# EAGLE schematic Grid (EAGLE 6.6.0)
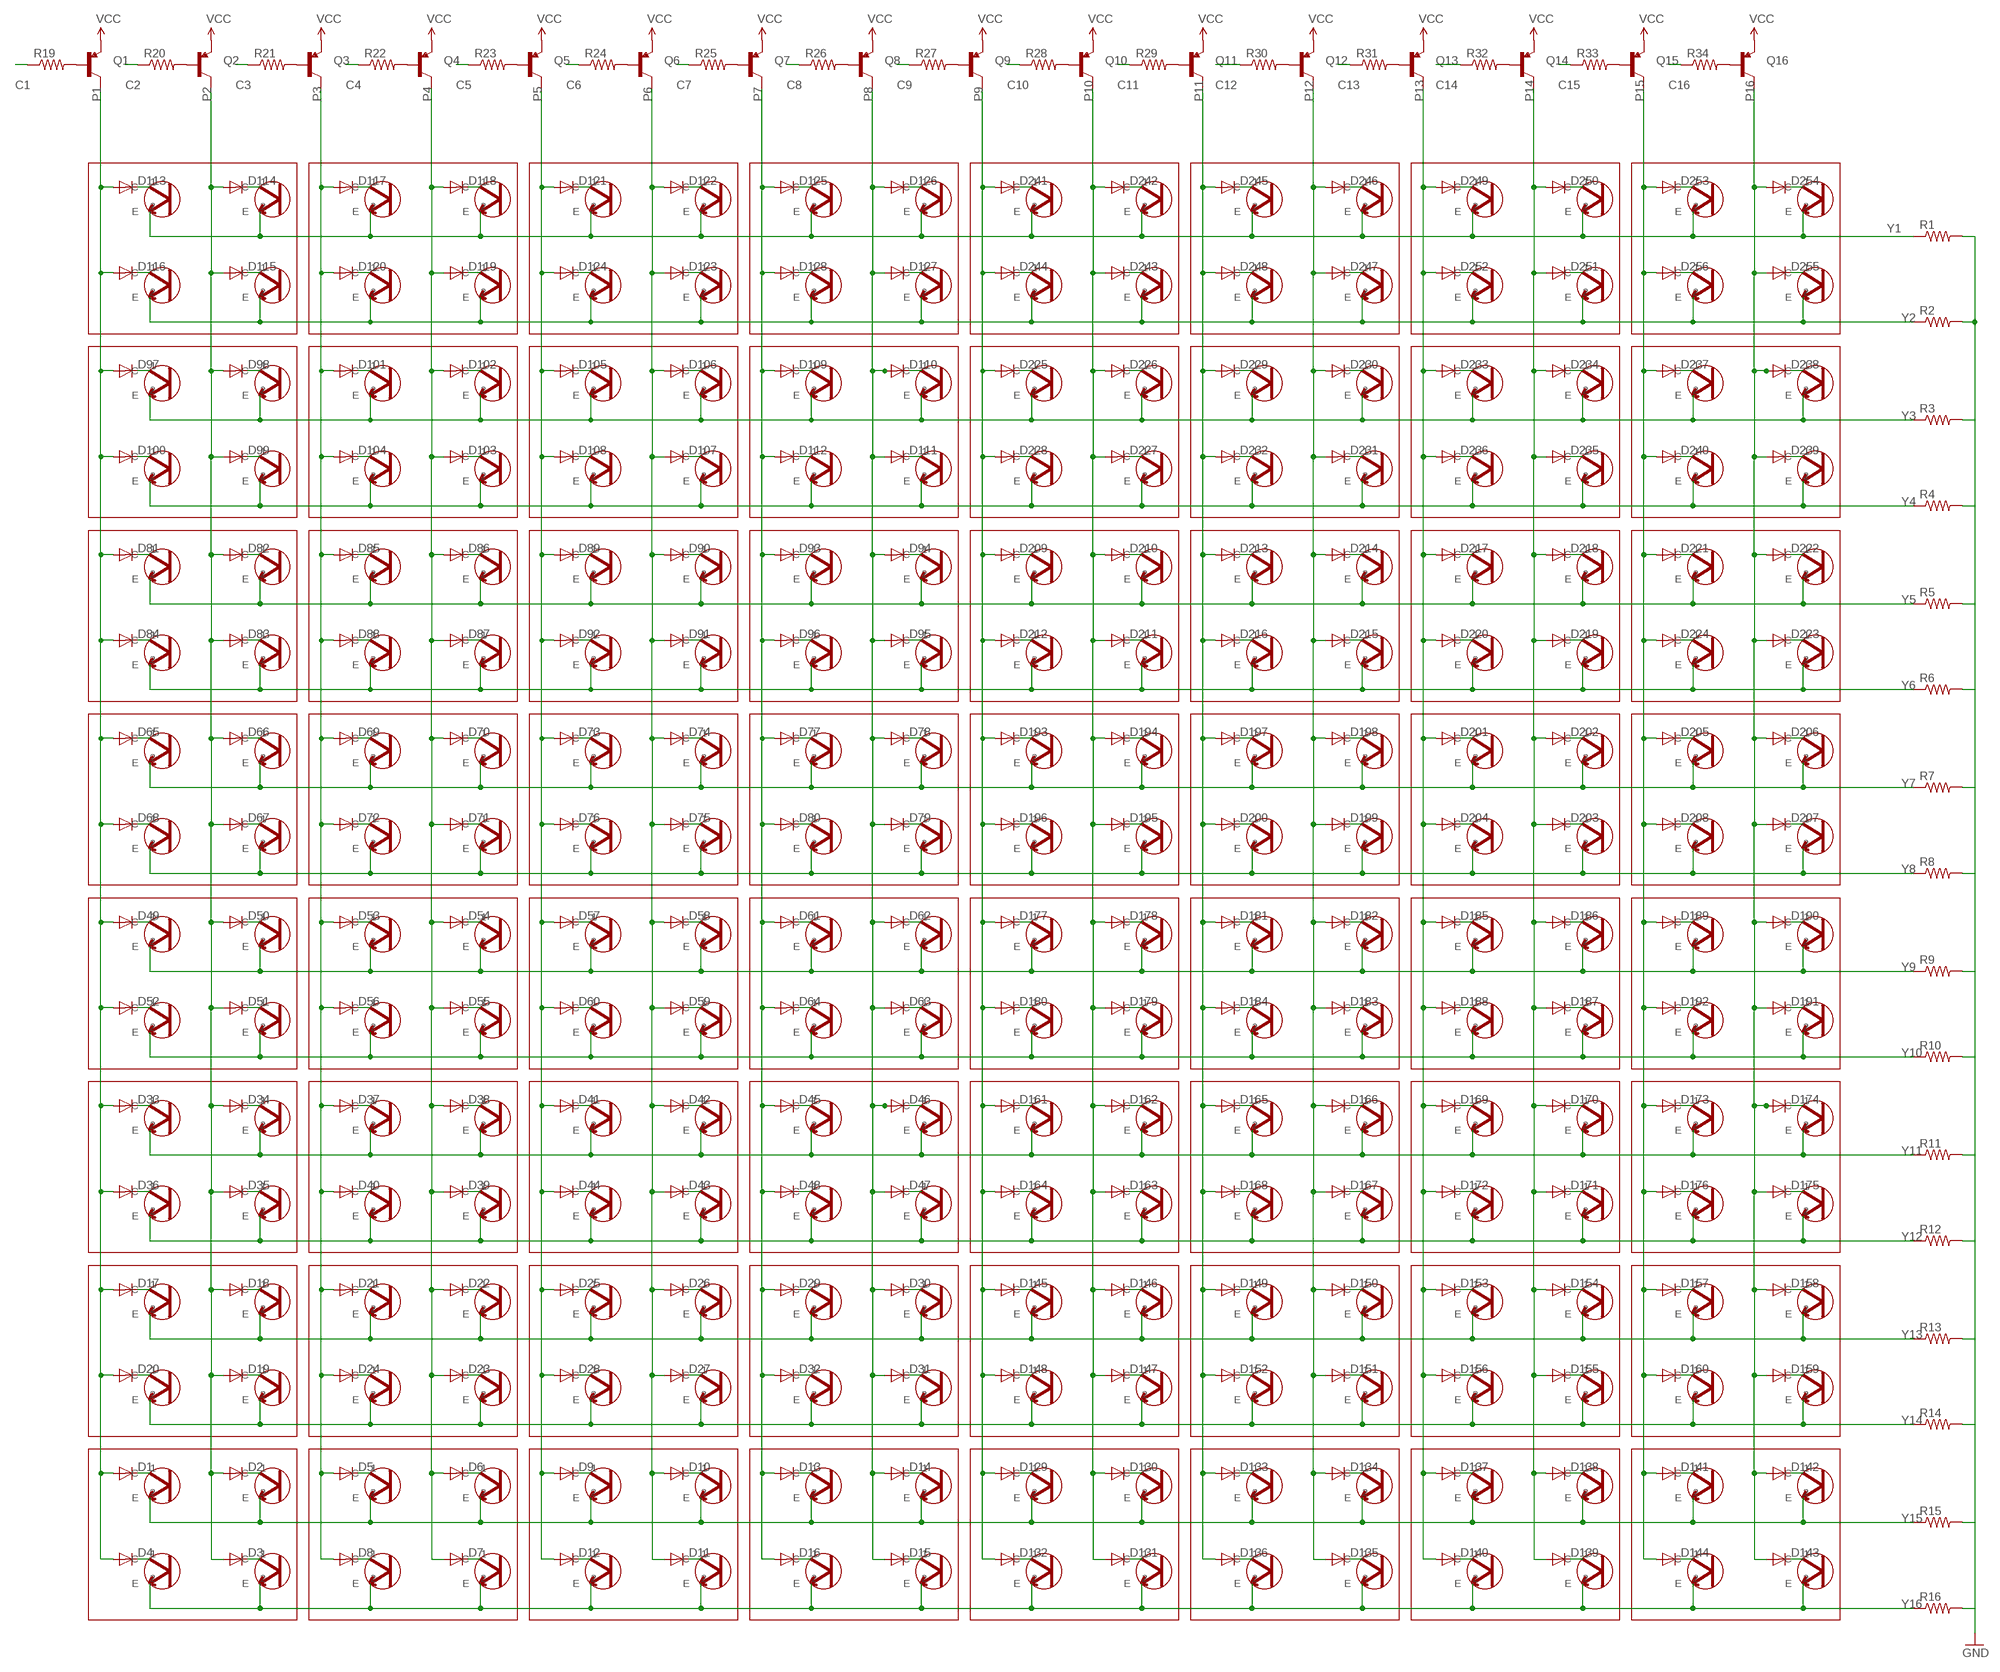
[diagram p0: schematic, sheet 1, part 1 of 2]
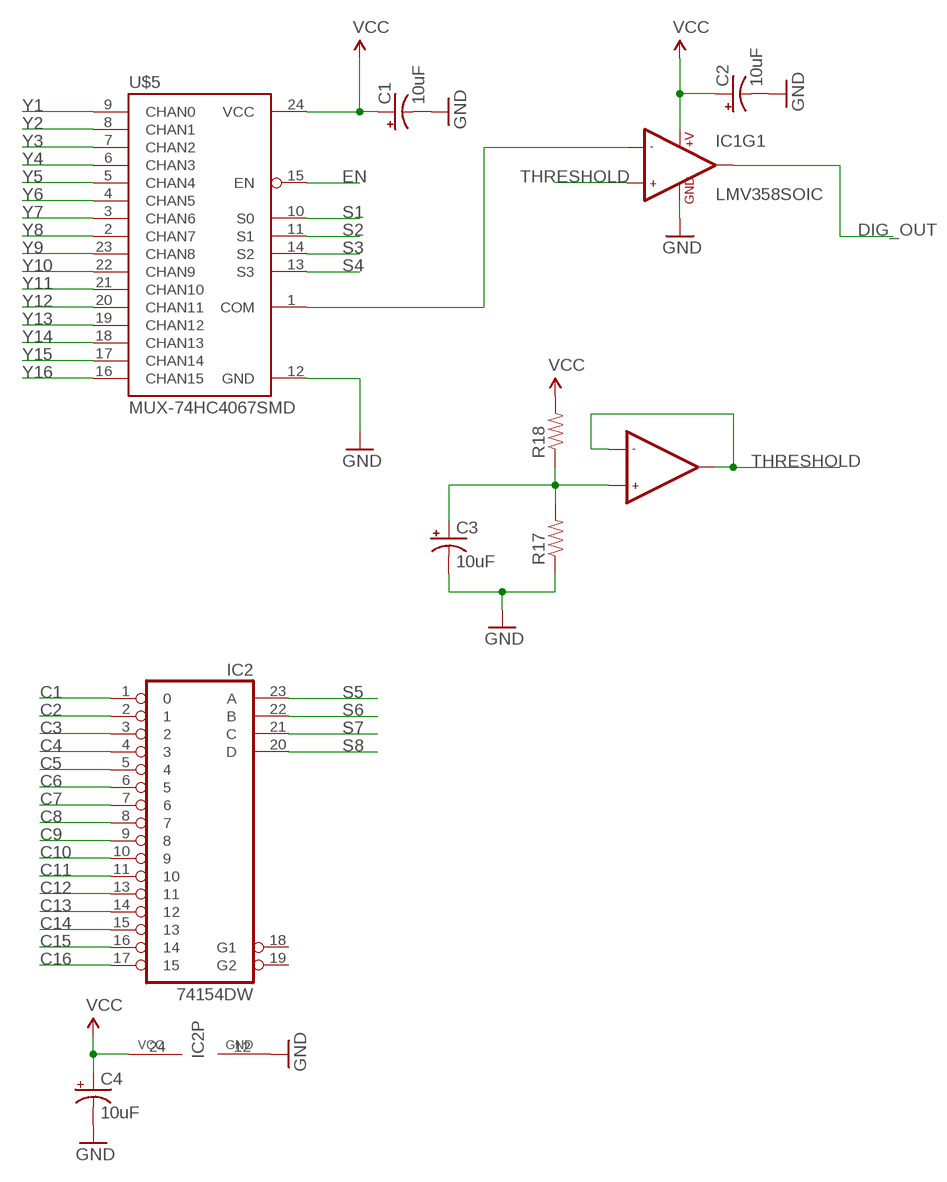
[diagram p1: schematic, sheet 1, part 2 of 2]

## Parts
C1  10uF  CAP_POL1206  [EIA3216]
C2  10uF  CAP_POL1206  [EIA3216]
C3  10uF  CAP_POL1206  [EIA3216]
C4  10uF  CAP_POL1206  [EIA3216]
D1  DIODESOD  [SOD-323]
D2  DIODESOD  [SOD-323]
D3  DIODESOD  [SOD-323]
D4  DIODESOD  [SOD-323]
D5  DIODESOD  [SOD-323]
D6  DIODESOD  [SOD-323]
D7  DIODESOD  [SOD-323]
D8  DIODESOD  [SOD-323]
D9  DIODESOD  [SOD-323]
D10  DIODESOD  [SOD-323]
D11  DIODESOD  [SOD-323]
D12  DIODESOD  [SOD-323]
D13  DIODESOD  [SOD-323]
D14  DIODESOD  [SOD-323]
D15  DIODESOD  [SOD-323]
D16  DIODESOD  [SOD-323]
D17  DIODESOD  [SOD-323]
D18  DIODESOD  [SOD-323]
D19  DIODESOD  [SOD-323]
D20  DIODESOD  [SOD-323]
D21  DIODESOD  [SOD-323]
D22  DIODESOD  [SOD-323]
D23  DIODESOD  [SOD-323]
D24  DIODESOD  [SOD-323]
D25  DIODESOD  [SOD-323]
D26  DIODESOD  [SOD-323]
D27  DIODESOD  [SOD-323]
D28  DIODESOD  [SOD-323]
D29  DIODESOD  [SOD-323]
D30  DIODESOD  [SOD-323]
D31  DIODESOD  [SOD-323]
D32  DIODESOD  [SOD-323]
D33  DIODESOD  [SOD-323]
D34  DIODESOD  [SOD-323]
D35  DIODESOD  [SOD-323]
D36  DIODESOD  [SOD-323]
D37  DIODESOD  [SOD-323]
D38  DIODESOD  [SOD-323]
D39  DIODESOD  [SOD-323]
D40  DIODESOD  [SOD-323]
D41  DIODESOD  [SOD-323]
D42  DIODESOD  [SOD-323]
D43  DIODESOD  [SOD-323]
D44  DIODESOD  [SOD-323]
D45  DIODESOD  [SOD-323]
D46  DIODESOD  [SOD-323]
D47  DIODESOD  [SOD-323]
D48  DIODESOD  [SOD-323]
D49  DIODESOD  [SOD-323]
D50  DIODESOD  [SOD-323]
D51  DIODESOD  [SOD-323]
D52  DIODESOD  [SOD-323]
D53  DIODESOD  [SOD-323]
D54  DIODESOD  [SOD-323]
D55  DIODESOD  [SOD-323]
D56  DIODESOD  [SOD-323]
D57  DIODESOD  [SOD-323]
D58  DIODESOD  [SOD-323]
D59  DIODESOD  [SOD-323]
D60  DIODESOD  [SOD-323]
D61  DIODESOD  [SOD-323]
D62  DIODESOD  [SOD-323]
D63  DIODESOD  [SOD-323]
D64  DIODESOD  [SOD-323]
D65  DIODESOD  [SOD-323]
D66  DIODESOD  [SOD-323]
D67  DIODESOD  [SOD-323]
D68  DIODESOD  [SOD-323]
D69  DIODESOD  [SOD-323]
D70  DIODESOD  [SOD-323]
D71  DIODESOD  [SOD-323]
D72  DIODESOD  [SOD-323]
D73  DIODESOD  [SOD-323]
D74  DIODESOD  [SOD-323]
D75  DIODESOD  [SOD-323]
D76  DIODESOD  [SOD-323]
D77  DIODESOD  [SOD-323]
D78  DIODESOD  [SOD-323]
D79  DIODESOD  [SOD-323]
D80  DIODESOD  [SOD-323]
D81  DIODESOD  [SOD-323]
D82  DIODESOD  [SOD-323]
D83  DIODESOD  [SOD-323]
D84  DIODESOD  [SOD-323]
D85  DIODESOD  [SOD-323]
D86  DIODESOD  [SOD-323]
D87  DIODESOD  [SOD-323]
D88  DIODESOD  [SOD-323]
D89  DIODESOD  [SOD-323]
D90  DIODESOD  [SOD-323]
D91  DIODESOD  [SOD-323]
D92  DIODESOD  [SOD-323]
D93  DIODESOD  [SOD-323]
D94  DIODESOD  [SOD-323]
D95  DIODESOD  [SOD-323]
D96  DIODESOD  [SOD-323]
D97  DIODESOD  [SOD-323]
D98  DIODESOD  [SOD-323]
D99  DIODESOD  [SOD-323]
D100  DIODESOD  [SOD-323]
D101  DIODESOD  [SOD-323]
D102  DIODESOD  [SOD-323]
D103  DIODESOD  [SOD-323]
D104  DIODESOD  [SOD-323]
D105  DIODESOD  [SOD-323]
D106  DIODESOD  [SOD-323]
D107  DIODESOD  [SOD-323]
D108  DIODESOD  [SOD-323]
D109  DIODESOD  [SOD-323]
D110  DIODESOD  [SOD-323]
D111  DIODESOD  [SOD-323]
D112  DIODESOD  [SOD-323]
D113  DIODESOD  [SOD-323]
D114  DIODESOD  [SOD-323]
D115  DIODESOD  [SOD-323]
D116  DIODESOD  [SOD-323]
D117  DIODESOD  [SOD-323]
D118  DIODESOD  [SOD-323]
D119  DIODESOD  [SOD-323]
D120  DIODESOD  [SOD-323]
D121  DIODESOD  [SOD-323]
D122  DIODESOD  [SOD-323]
D123  DIODESOD  [SOD-323]
D124  DIODESOD  [SOD-323]
D125  DIODESOD  [SOD-323]
D126  DIODESOD  [SOD-323]
D127  DIODESOD  [SOD-323]
D128  DIODESOD  [SOD-323]
D129  DIODESOD  [SOD-323]
D130  DIODESOD  [SOD-323]
D131  DIODESOD  [SOD-323]
D132  DIODESOD  [SOD-323]
D133  DIODESOD  [SOD-323]
D134  DIODESOD  [SOD-323]
D135  DIODESOD  [SOD-323]
D136  DIODESOD  [SOD-323]
D137  DIODESOD  [SOD-323]
D138  DIODESOD  [SOD-323]
D139  DIODESOD  [SOD-323]
D140  DIODESOD  [SOD-323]
D141  DIODESOD  [SOD-323]
D142  DIODESOD  [SOD-323]
D143  DIODESOD  [SOD-323]
D144  DIODESOD  [SOD-323]
D145  DIODESOD  [SOD-323]
D146  DIODESOD  [SOD-323]
D147  DIODESOD  [SOD-323]
D148  DIODESOD  [SOD-323]
D149  DIODESOD  [SOD-323]
D150  DIODESOD  [SOD-323]
D151  DIODESOD  [SOD-323]
D152  DIODESOD  [SOD-323]
D153  DIODESOD  [SOD-323]
D154  DIODESOD  [SOD-323]
D155  DIODESOD  [SOD-323]
D156  DIODESOD  [SOD-323]
D157  DIODESOD  [SOD-323]
D158  DIODESOD  [SOD-323]
D159  DIODESOD  [SOD-323]
D160  DIODESOD  [SOD-323]
D161  DIODESOD  [SOD-323]
D162  DIODESOD  [SOD-323]
D163  DIODESOD  [SOD-323]
D164  DIODESOD  [SOD-323]
D165  DIODESOD  [SOD-323]
D166  DIODESOD  [SOD-323]
D167  DIODESOD  [SOD-323]
D168  DIODESOD  [SOD-323]
D169  DIODESOD  [SOD-323]
D170  DIODESOD  [SOD-323]
D171  DIODESOD  [SOD-323]
D172  DIODESOD  [SOD-323]
D173  DIODESOD  [SOD-323]
D174  DIODESOD  [SOD-323]
D175  DIODESOD  [SOD-323]
D176  DIODESOD  [SOD-323]
D177  DIODESOD  [SOD-323]
D178  DIODESOD  [SOD-323]
D179  DIODESOD  [SOD-323]
D180  DIODESOD  [SOD-323]
D181  DIODESOD  [SOD-323]
D182  DIODESOD  [SOD-323]
D183  DIODESOD  [SOD-323]
D184  DIODESOD  [SOD-323]
D185  DIODESOD  [SOD-323]
D186  DIODESOD  [SOD-323]
D187  DIODESOD  [SOD-323]
D188  DIODESOD  [SOD-323]
D189  DIODESOD  [SOD-323]
D190  DIODESOD  [SOD-323]
D191  DIODESOD  [SOD-323]
D192  DIODESOD  [SOD-323]
D193  DIODESOD  [SOD-323]
D194  DIODESOD  [SOD-323]
D195  DIODESOD  [SOD-323]
D196  DIODESOD  [SOD-323]
D197  DIODESOD  [SOD-323]
D198  DIODESOD  [SOD-323]
D199  DIODESOD  [SOD-323]
D200  DIODESOD  [SOD-323]
D201  DIODESOD  [SOD-323]
D202  DIODESOD  [SOD-323]
D203  DIODESOD  [SOD-323]
D204  DIODESOD  [SOD-323]
D205  DIODESOD  [SOD-323]
D206  DIODESOD  [SOD-323]
D207  DIODESOD  [SOD-323]
D208  DIODESOD  [SOD-323]
D209  DIODESOD  [SOD-323]
D210  DIODESOD  [SOD-323]
D211  DIODESOD  [SOD-323]
D212  DIODESOD  [SOD-323]
D213  DIODESOD  [SOD-323]
D214  DIODESOD  [SOD-323]
D215  DIODESOD  [SOD-323]
D216  DIODESOD  [SOD-323]
D217  DIODESOD  [SOD-323]
D218  DIODESOD  [SOD-323]
D219  DIODESOD  [SOD-323]
D220  DIODESOD  [SOD-323]
D221  DIODESOD  [SOD-323]
D222  DIODESOD  [SOD-323]
D223  DIODESOD  [SOD-323]
D224  DIODESOD  [SOD-323]
D225  DIODESOD  [SOD-323]
D226  DIODESOD  [SOD-323]
D227  DIODESOD  [SOD-323]
D228  DIODESOD  [SOD-323]
D229  DIODESOD  [SOD-323]
D230  DIODESOD  [SOD-323]
D231  DIODESOD  [SOD-323]
D232  DIODESOD  [SOD-323]
D233  DIODESOD  [SOD-323]
D234  DIODESOD  [SOD-323]
D235  DIODESOD  [SOD-323]
D236  DIODESOD  [SOD-323]
D237  DIODESOD  [SOD-323]
D238  DIODESOD  [SOD-323]
D239  DIODESOD  [SOD-323]
D240  DIODESOD  [SOD-323]
D241  DIODESOD  [SOD-323]
D242  DIODESOD  [SOD-323]
D243  DIODESOD  [SOD-323]
D244  DIODESOD  [SOD-323]
D245  DIODESOD  [SOD-323]
D246  DIODESOD  [SOD-323]
D247  DIODESOD  [SOD-323]
D248  DIODESOD  [SOD-323]
D249  DIODESOD  [SOD-323]
D250  DIODESOD  [SOD-323]
D251  DIODESOD  [SOD-323]
D252  DIODESOD  [SOD-323]
D253  DIODESOD  [SOD-323]
D254  DIODESOD  [SOD-323]
D255  DIODESOD  [SOD-323]
D256  DIODESOD  [SOD-323]
IC1  LMV358SOIC  [SO08]
IC2  74154DW  [SO24W]
Q1  TRANSISTOR_PNPSMD  [SOT23-3]
Q2  TRANSISTOR_PNPSMD  [SOT23-3]
Q3  TRANSISTOR_PNPSMD  [SOT23-3]
Q4  TRANSISTOR_PNPSMD  [SOT23-3]
Q5  TRANSISTOR_PNPSMD  [SOT23-3]
Q6  TRANSISTOR_PNPSMD  [SOT23-3]
Q7  TRANSISTOR_PNPSMD  [SOT23-3]
Q8  TRANSISTOR_PNPSMD  [SOT23-3]
Q9  TRANSISTOR_PNPSMD  [SOT23-3]
Q10  TRANSISTOR_PNPSMD  [SOT23-3]
Q11  TRANSISTOR_PNPSMD  [SOT23-3]
Q12  TRANSISTOR_PNPSMD  [SOT23-3]
Q13  TRANSISTOR_PNPSMD  [SOT23-3]
Q14  TRANSISTOR_PNPSMD  [SOT23-3]
Q15  TRANSISTOR_PNPSMD  [SOT23-3]
Q16  TRANSISTOR_PNPSMD  [SOT23-3]
R1  RESISTOR0603  [0603-RES]
R2  RESISTOR0603  [0603-RES]
R3  RESISTOR0603  [0603-RES]
R4  RESISTOR0603  [0603-RES]
R5  RESISTOR0603  [0603-RES]
R6  RESISTOR0603  [0603-RES]
R7  RESISTOR0603  [0603-RES]
R8  RESISTOR0603  [0603-RES]
R9  RESISTOR0603  [0603-RES]
R10  RESISTOR0603  [0603-RES]
R11  RESISTOR0603  [0603-RES]
R12  RESISTOR0603  [0603-RES]
R13  RESISTOR0603  [0603-RES]
R14  RESISTOR0603  [0603-RES]
R15  RESISTOR0603  [0603-RES]
R16  RESISTOR0603  [0603-RES]
R17  RESISTOR0603  [0603-RES]
R18  RESISTOR0603  [0603-RES]
R19  RESISTOR0603  [0603-RES]
R20  RESISTOR0603  [0603-RES]
R21  RESISTOR0603  [0603-RES]
R22  RESISTOR0603  [0603-RES]
R23  RESISTOR0603  [0603-RES]
R24  RESISTOR0603  [0603-RES]
R25  RESISTOR0603  [0603-RES]
R26  RESISTOR0603  [0603-RES]
R27  RESISTOR0603  [0603-RES]
R28  RESISTOR0603  [0603-RES]
R29  RESISTOR0603  [0603-RES]
R30  RESISTOR0603  [0603-RES]
R31  RESISTOR0603  [0603-RES]
R32  RESISTOR0603  [0603-RES]
R33  RESISTOR0603  [0603-RES]
R34  RESISTOR0603  [0603-RES]
U$1  PT15-21B  [1206]
U$2  PT15-21B  [1206]
U$3  PT15-21B  [1206]
U$4  PT15-21B  [1206]
U$5  MUX-74HC4067SMD  [SSOP24]
U$6  PT15-21B  [1206]
U$7  PT15-21B  [1206]
U$8  PT15-21B  [1206]
U$9  PT15-21B  [1206]
U$10  PT15-21B  [1206]
U$11  PT15-21B  [1206]
U$12  PT15-21B  [1206]
U$13  PT15-21B  [1206]
U$14  PT15-21B  [1206]
U$15  PT15-21B  [1206]
U$16  PT15-21B  [1206]
U$17  PT15-21B  [1206]
U$18  PT15-21B  [1206]
U$19  PT15-21B  [1206]
U$20  PT15-21B  [1206]
U$21  PT15-21B  [1206]
U$22  PT15-21B  [1206]
U$23  PT15-21B  [1206]
U$24  PT15-21B  [1206]
U$25  PT15-21B  [1206]
U$26  PT15-21B  [1206]
U$27  PT15-21B  [1206]
U$28  PT15-21B  [1206]
U$29  PT15-21B  [1206]
U$30  PT15-21B  [1206]
U$31  PT15-21B  [1206]
U$32  PT15-21B  [1206]
U$33  PT15-21B  [1206]
U$34  PT15-21B  [1206]
U$35  PT15-21B  [1206]
U$36  PT15-21B  [1206]
U$37  PT15-21B  [1206]
U$38  PT15-21B  [1206]
U$39  PT15-21B  [1206]
U$40  PT15-21B  [1206]
U$41  PT15-21B  [1206]
U$42  PT15-21B  [1206]
U$43  PT15-21B  [1206]
U$44  PT15-21B  [1206]
U$45  PT15-21B  [1206]
U$46  PT15-21B  [1206]
U$47  PT15-21B  [1206]
U$48  PT15-21B  [1206]
U$49  PT15-21B  [1206]
U$50  PT15-21B  [1206]
U$51  PT15-21B  [1206]
U$52  PT15-21B  [1206]
U$53  PT15-21B  [1206]
U$54  PT15-21B  [1206]
U$55  PT15-21B  [1206]
U$56  PT15-21B  [1206]
U$57  PT15-21B  [1206]
U$58  PT15-21B  [1206]
U$59  PT15-21B  [1206]
U$60  PT15-21B  [1206]
U$61  PT15-21B  [1206]
U$62  PT15-21B  [1206]
U$63  PT15-21B  [1206]
U$64  PT15-21B  [1206]
U$65  PT15-21B  [1206]
U$66  PT15-21B  [1206]
U$67  PT15-21B  [1206]
U$68  PT15-21B  [1206]
U$69  PT15-21B  [1206]
U$70  PT15-21B  [1206]
U$71  PT15-21B  [1206]
U$72  PT15-21B  [1206]
U$73  PT15-21B  [1206]
U$74  PT15-21B  [1206]
U$75  PT15-21B  [1206]
U$76  PT15-21B  [1206]
U$77  PT15-21B  [1206]
U$78  PT15-21B  [1206]
U$79  PT15-21B  [1206]
U$80  PT15-21B  [1206]
U$81  PT15-21B  [1206]
U$82  PT15-21B  [1206]
U$83  PT15-21B  [1206]
U$84  PT15-21B  [1206]
U$85  PT15-21B  [1206]
U$86  PT15-21B  [1206]
U$87  PT15-21B  [1206]
U$88  PT15-21B  [1206]
U$89  PT15-21B  [1206]
U$90  PT15-21B  [1206]
U$91  PT15-21B  [1206]
U$92  PT15-21B  [1206]
U$93  PT15-21B  [1206]
U$94  PT15-21B  [1206]
U$95  PT15-21B  [1206]
U$96  PT15-21B  [1206]
U$97  PT15-21B  [1206]
U$98  PT15-21B  [1206]
U$99  PT15-21B  [1206]
U$100  PT15-21B  [1206]
U$101  PT15-21B  [1206]
U$102  PT15-21B  [1206]
U$103  PT15-21B  [1206]
U$104  PT15-21B  [1206]
U$105  PT15-21B  [1206]
U$106  PT15-21B  [1206]
U$107  PT15-21B  [1206]
U$108  PT15-21B  [1206]
U$109  PT15-21B  [1206]
U$110  PT15-21B  [1206]
U$111  PT15-21B  [1206]
U$112  PT15-21B  [1206]
U$113  PT15-21B  [1206]
U$114  PT15-21B  [1206]
U$115  PT15-21B  [1206]
U$116  PT15-21B  [1206]
U$117  PT15-21B  [1206]
U$118  PT15-21B  [1206]
U$119  PT15-21B  [1206]
U$120  PT15-21B  [1206]
U$121  PT15-21B  [1206]
U$122  PT15-21B  [1206]
U$123  PT15-21B  [1206]
U$124  PT15-21B  [1206]
U$125  PT15-21B  [1206]
U$126  PT15-21B  [1206]
U$127  PT15-21B  [1206]
U$128  PT15-21B  [1206]
U$129  PT15-21B  [1206]
U$130  PT15-21B  [1206]
U$131  PT15-21B  [1206]
U$132  PT15-21B  [1206]
U$133  PT15-21B  [1206]
U$134  PT15-21B  [1206]
U$135  PT15-21B  [1206]
U$136  PT15-21B  [1206]
U$137  PT15-21B  [1206]
U$138  PT15-21B  [1206]
U$139  PT15-21B  [1206]
U$140  PT15-21B  [1206]
U$141  PT15-21B  [1206]
U$142  PT15-21B  [1206]
U$143  PT15-21B  [1206]
U$144  PT15-21B  [1206]
U$145  PT15-21B  [1206]
U$146  PT15-21B  [1206]
U$147  PT15-21B  [1206]
U$148  PT15-21B  [1206]
U$149  PT15-21B  [1206]
U$150  PT15-21B  [1206]
U$151  PT15-21B  [1206]
U$152  PT15-21B  [1206]
U$153  PT15-21B  [1206]
U$154  PT15-21B  [1206]
U$155  PT15-21B  [1206]
U$156  PT15-21B  [1206]
U$157  PT15-21B  [1206]
U$158  PT15-21B  [1206]
U$159  PT15-21B  [1206]
U$160  PT15-21B  [1206]
U$161  PT15-21B  [1206]
U$162  PT15-21B  [1206]
U$163  PT15-21B  [1206]
U$164  PT15-21B  [1206]
U$165  PT15-21B  [1206]
U$166  PT15-21B  [1206]
U$167  PT15-21B  [1206]
U$168  PT15-21B  [1206]
U$169  PT15-21B  [1206]
U$170  PT15-21B  [1206]
U$171  PT15-21B  [1206]
U$172  PT15-21B  [1206]
U$173  PT15-21B  [1206]
U$174  PT15-21B  [1206]
U$175  PT15-21B  [1206]
U$176  PT15-21B  [1206]
U$177  PT15-21B  [1206]
U$178  PT15-21B  [1206]
U$179  PT15-21B  [1206]
U$180  PT15-21B  [1206]
U$181  PT15-21B  [1206]
U$182  PT15-21B  [1206]
U$183  PT15-21B  [1206]
U$184  PT15-21B  [1206]
U$185  PT15-21B  [1206]
U$186  PT15-21B  [1206]
U$187  PT15-21B  [1206]
U$188  PT15-21B  [1206]
U$189  PT15-21B  [1206]
U$190  PT15-21B  [1206]
U$191  PT15-21B  [1206]
U$192  PT15-21B  [1206]
U$193  PT15-21B  [1206]
U$194  PT15-21B  [1206]
U$195  PT15-21B  [1206]
U$196  PT15-21B  [1206]
U$197  PT15-21B  [1206]
U$198  PT15-21B  [1206]
U$199  PT15-21B  [1206]
U$200  PT15-21B  [1206]
U$201  PT15-21B  [1206]
U$202  PT15-21B  [1206]
U$203  PT15-21B  [1206]
U$204  PT15-21B  [1206]
U$205  PT15-21B  [1206]
U$206  PT15-21B  [1206]
U$207  PT15-21B  [1206]
U$208  PT15-21B  [1206]
U$209  PT15-21B  [1206]
U$210  PT15-21B  [1206]
U$211  PT15-21B  [1206]
U$212  PT15-21B  [1206]
U$213  PT15-21B  [1206]
U$214  PT15-21B  [1206]
U$215  PT15-21B  [1206]
U$216  PT15-21B  [1206]
U$217  PT15-21B  [1206]
U$218  PT15-21B  [1206]
U$219  PT15-21B  [1206]
U$220  PT15-21B  [1206]
U$221  PT15-21B  [1206]
U$222  PT15-21B  [1206]
U$223  PT15-21B  [1206]
U$224  PT15-21B  [1206]
U$225  PT15-21B  [1206]
U$226  PT15-21B  [1206]
U$227  PT15-21B  [1206]
U$228  PT15-21B  [1206]
U$229  PT15-21B  [1206]
U$230  PT15-21B  [1206]
U$231  PT15-21B  [1206]
U$232  PT15-21B  [1206]
U$233  PT15-21B  [1206]
U$234  PT15-21B  [1206]
U$235  PT15-21B  [1206]
U$236  PT15-21B  [1206]
U$237  PT15-21B  [1206]
U$238  PT15-21B  [1206]
U$239  PT15-21B  [1206]
U$240  PT15-21B  [1206]
U$241  PT15-21B  [1206]
U$242  PT15-21B  [1206]
U$243  PT15-21B  [1206]
U$244  PT15-21B  [1206]
U$245  PT15-21B  [1206]
U$246  PT15-21B  [1206]
U$247  PT15-21B  [1206]
U$248  PT15-21B  [1206]
U$249  PT15-21B  [1206]
U$250  PT15-21B  [1206]
U$251  PT15-21B  [1206]
U$252  PT15-21B  [1206]
U$253  PT15-21B  [1206]
U$254  PT15-21B  [1206]
U$255  PT15-21B  [1206]
U$256  PT15-21B  [1206]
U$257  PT15-21B  [1206]

## Nets
C1: IC2.1 R19.1
C2: IC2.2 R20.1
C3: IC2.3 R21.1
C4: IC2.4 R22.1
C5: IC2.5 R23.1
C6: IC2.6 R24.1
C7: IC2.7 R25.1
C8: IC2.8 R26.1
C9: IC2.9 R27.1
C10: IC2.10 R28.1
C11: IC2.11 R29.1
C12: IC2.13 R30.1
C13: IC2.14 R31.1
C14: IC2.15 R32.1
C15: IC2.16 R33.1
C16: IC2.17 R34.1
DIG_OUT: IC1.1(OUT1)
EN: U$5.15(EN)
GND: C1.C(-) C2.C(-) C3.C(-) C4.C(-) IC1.4(GND) IC2.12(GND) R1.2 R2.2 R3.2 R4.2 R5.2 R6.2 R7.2 R8.2 R9.2 R10.2 R11.2 R12.2 R13.2 R14.2 R15.2 R16.2 R17.1 U$5.12(GND)
N$1: Q1.1(B) R19.2
N$2: Q2.1(B) R20.2
N$3: IC1.2(-IN1) U$5.1(COM)
N$4: D2.1(C) U$2.1(C)
N$5: C3.A(+) IC1.5(+IN2) R17.2 R18.1
N$6: D1.1(C) U$1.1(C)
N$7: D4.1(C) U$4.1(C)
N$8: D3.1(C) U$3.1(C)
N$9: Q3.1(B) R21.2
N$10: Q4.1(B) R22.2
N$11: Q5.1(B) R23.2
N$12: Q6.1(B) R24.2
N$13: D5.1(C) U$6.1(C)
N$14: D6.1(C) U$7.1(C)
N$15: D8.1(C) U$9.1(C)
N$16: D7.1(C) U$8.1(C)
N$17: Q7.1(B) R25.2
N$18: Q8.1(B) R26.2
N$19: Q9.1(B) R27.2
N$20: Q10.1(B) R28.2
N$21: D9.1(C) U$10.1(C)
N$22: D10.1(C) U$11.1(C)
N$23: D12.1(C) U$13.1(C)
N$24: D11.1(C) U$12.1(C)
N$25: Q11.1(B) R29.2
N$26: Q12.1(B) R30.2
N$27: Q13.1(B) R31.2
N$28: Q14.1(B) R32.2
N$29: D13.1(C) U$14.1(C)
N$30: D14.1(C) U$15.1(C)
N$31: D16.1(C) U$17.1(C)
N$32: D15.1(C) U$16.1(C)
N$33: Q15.1(B) R33.2
N$34: Q16.1(B) R34.2
N$37: D17.1(C) U$18.1(C)
N$38: D18.1(C) U$19.1(C)
N$39: D20.1(C) U$21.1(C)
N$40: D19.1(C) U$20.1(C)
N$45: D21.1(C) U$22.1(C)
N$46: D22.1(C) U$23.1(C)
N$47: D24.1(C) U$25.1(C)
N$48: D23.1(C) U$24.1(C)
N$53: D25.1(C) U$26.1(C)
N$54: D26.1(C) U$27.1(C)
N$55: D28.1(C) U$29.1(C)
N$56: D27.1(C) U$28.1(C)
N$61: D29.1(C) U$30.1(C)
N$62: D30.1(C) U$31.1(C)
N$63: D32.1(C) U$33.1(C)
N$64: D31.1(C) U$32.1(C)
N$69: D33.1(C) U$34.1(C)
N$70: D34.1(C) U$35.1(C)
N$71: D36.1(C) U$37.1(C)
N$72: D35.1(C) U$36.1(C)
N$77: D37.1(C) U$38.1(C)
N$78: D38.1(C) U$39.1(C)
N$79: D40.1(C) U$41.1(C)
N$80: D39.1(C) U$40.1(C)
N$85: D41.1(C) U$42.1(C)
N$86: D42.1(C) U$43.1(C)
N$87: D44.1(C) U$45.1(C)
N$88: D43.1(C) U$44.1(C)
N$93: D45.1(C) U$46.1(C)
N$94: D46.1(C) U$47.1(C)
N$95: D48.1(C) U$49.1(C)
N$96: D47.1(C) U$48.1(C)
N$101: D49.1(C) U$50.1(C)
N$102: D50.1(C) U$51.1(C)
N$103: D52.1(C) U$53.1(C)
N$104: D51.1(C) U$52.1(C)
N$109: D53.1(C) U$54.1(C)
N$110: D54.1(C) U$55.1(C)
N$111: D56.1(C) U$57.1(C)
N$112: D55.1(C) U$56.1(C)
N$117: D57.1(C) U$58.1(C)
N$118: D58.1(C) U$59.1(C)
N$119: D60.1(C) U$61.1(C)
N$120: D59.1(C) U$60.1(C)
N$125: D61.1(C) U$62.1(C)
N$126: D62.1(C) U$63.1(C)
N$127: D64.1(C) U$65.1(C)
N$128: D63.1(C) U$64.1(C)
N$133: D65.1(C) U$66.1(C)
N$134: D66.1(C) U$67.1(C)
N$135: D68.1(C) U$69.1(C)
N$136: D67.1(C) U$68.1(C)
N$139: D69.1(C) U$70.1(C)
N$140: D70.1(C) U$71.1(C)
N$141: D72.1(C) U$73.1(C)
N$142: D71.1(C) U$72.1(C)
N$145: D73.1(C) U$74.1(C)
N$146: D74.1(C) U$75.1(C)
N$147: D76.1(C) U$77.1(C)
N$148: D75.1(C) U$76.1(C)
N$151: D77.1(C) U$78.1(C)
N$152: D78.1(C) U$79.1(C)
N$153: D80.1(C) U$81.1(C)
N$154: D79.1(C) U$80.1(C)
N$157: D81.1(C) U$82.1(C)
N$158: D82.1(C) U$83.1(C)
N$159: D84.1(C) U$85.1(C)
N$160: D83.1(C) U$84.1(C)
N$161: D85.1(C) U$86.1(C)
N$162: D86.1(C) U$87.1(C)
N$163: D88.1(C) U$89.1(C)
N$164: D87.1(C) U$88.1(C)
N$165: D89.1(C) U$90.1(C)
N$166: D90.1(C) U$91.1(C)
N$167: D92.1(C) U$93.1(C)
N$168: D91.1(C) U$92.1(C)
N$169: D93.1(C) U$94.1(C)
N$170: D94.1(C) U$95.1(C)
N$171: D96.1(C) U$97.1(C)
N$172: D95.1(C) U$96.1(C)
N$175: D97.1(C) U$98.1(C)
N$176: D98.1(C) U$99.1(C)
N$177: D100.1(C) U$101.1(C)
N$178: D99.1(C) U$100.1(C)
N$179: D101.1(C) U$102.1(C)
N$180: D102.1(C) U$103.1(C)
N$181: D104.1(C) U$105.1(C)
N$182: D103.1(C) U$104.1(C)
N$183: D105.1(C) U$106.1(C)
N$184: D106.1(C) U$107.1(C)
N$185: D108.1(C) U$109.1(C)
N$186: D107.1(C) U$108.1(C)
N$187: D109.1(C) U$110.1(C)
N$188: D110.1(C) U$111.1(C)
N$189: D112.1(C) U$113.1(C)
N$190: D111.1(C) U$112.1(C)
N$193: D113.1(C) U$114.1(C)
N$194: D114.1(C) U$115.1(C)
N$195: D116.1(C) U$117.1(C)
N$196: D115.1(C) U$116.1(C)
N$197: D117.1(C) U$118.1(C)
N$198: D118.1(C) U$119.1(C)
N$199: D120.1(C) U$121.1(C)
N$200: D119.1(C) U$120.1(C)
N$201: D121.1(C) U$122.1(C)
N$202: D122.1(C) U$123.1(C)
N$203: D124.1(C) U$125.1(C)
N$204: D123.1(C) U$124.1(C)
N$205: D125.1(C) U$126.1(C)
N$206: D126.1(C) U$127.1(C)
N$207: D128.1(C) U$129.1(C)
N$208: D127.1(C) U$128.1(C)
N$213: D129.1(C) U$130.1(C)
N$214: D130.1(C) U$131.1(C)
N$215: D132.1(C) U$133.1(C)
N$216: D131.1(C) U$132.1(C)
N$219: D133.1(C) U$134.1(C)
N$220: D134.1(C) U$135.1(C)
N$221: D136.1(C) U$137.1(C)
N$222: D135.1(C) U$136.1(C)
N$225: D137.1(C) U$138.1(C)
N$226: D138.1(C) U$139.1(C)
N$227: D140.1(C) U$141.1(C)
N$228: D139.1(C) U$140.1(C)
N$231: D141.1(C) U$142.1(C)
N$232: D142.1(C) U$143.1(C)
N$233: D144.1(C) U$145.1(C)
N$234: D143.1(C) U$144.1(C)
N$237: D145.1(C) U$146.1(C)
N$238: D146.1(C) U$147.1(C)
N$239: D148.1(C) U$149.1(C)
N$240: D147.1(C) U$148.1(C)
N$241: D149.1(C) U$150.1(C)
N$242: D150.1(C) U$151.1(C)
N$243: D152.1(C) U$153.1(C)
N$244: D151.1(C) U$152.1(C)
N$245: D153.1(C) U$154.1(C)
N$246: D154.1(C) U$155.1(C)
N$247: D156.1(C) U$157.1(C)
N$248: D155.1(C) U$156.1(C)
N$249: D157.1(C) U$158.1(C)
N$250: D158.1(C) U$159.1(C)
N$251: D160.1(C) U$161.1(C)
N$252: D159.1(C) U$160.1(C)
N$255: D161.1(C) U$162.1(C)
N$256: D162.1(C) U$163.1(C)
N$257: D164.1(C) U$165.1(C)
N$258: D163.1(C) U$164.1(C)
N$259: D165.1(C) U$166.1(C)
N$260: D166.1(C) U$167.1(C)
N$261: D168.1(C) U$169.1(C)
N$262: D167.1(C) U$168.1(C)
N$263: D169.1(C) U$170.1(C)
N$264: D170.1(C) U$171.1(C)
N$265: D172.1(C) U$173.1(C)
N$266: D171.1(C) U$172.1(C)
N$267: D173.1(C) U$174.1(C)
N$268: D174.1(C) U$175.1(C)
N$269: D176.1(C) U$177.1(C)
N$270: D175.1(C) U$176.1(C)
N$273: D177.1(C) U$178.1(C)
N$274: D178.1(C) U$179.1(C)
N$275: D180.1(C) U$181.1(C)
N$276: D179.1(C) U$180.1(C)
N$277: D181.1(C) U$182.1(C)
N$278: D182.1(C) U$183.1(C)
N$279: D184.1(C) U$185.1(C)
N$280: D183.1(C) U$184.1(C)
N$281: D185.1(C) U$186.1(C)
N$282: D186.1(C) U$187.1(C)
N$283: D188.1(C) U$189.1(C)
N$284: D187.1(C) U$188.1(C)
N$285: D189.1(C) U$190.1(C)
N$286: D190.1(C) U$191.1(C)
N$287: D192.1(C) U$193.1(C)
N$288: D191.1(C) U$192.1(C)
N$291: D193.1(C) U$194.1(C)
N$292: D194.1(C) U$195.1(C)
N$293: D196.1(C) U$197.1(C)
N$294: D195.1(C) U$196.1(C)
N$295: D197.1(C) U$198.1(C)
N$296: D198.1(C) U$199.1(C)
N$297: D200.1(C) U$201.1(C)
N$298: D199.1(C) U$200.1(C)
N$299: D201.1(C) U$202.1(C)
N$300: D202.1(C) U$203.1(C)
N$301: D204.1(C) U$205.1(C)
N$302: D203.1(C) U$204.1(C)
N$303: D205.1(C) U$206.1(C)
N$304: D206.1(C) U$207.1(C)
N$305: D208.1(C) U$209.1(C)
N$306: D207.1(C) U$208.1(C)
N$309: D209.1(C) U$210.1(C)
N$310: D210.1(C) U$211.1(C)
N$311: D212.1(C) U$213.1(C)
N$312: D211.1(C) U$212.1(C)
N$313: D213.1(C) U$214.1(C)
N$314: D214.1(C) U$215.1(C)
N$315: D216.1(C) U$217.1(C)
N$316: D215.1(C) U$216.1(C)
N$317: D217.1(C) U$218.1(C)
N$318: D218.1(C) U$219.1(C)
N$319: D220.1(C) U$221.1(C)
N$320: D219.1(C) U$220.1(C)
N$321: D221.1(C) U$222.1(C)
N$322: D222.1(C) U$223.1(C)
N$323: D224.1(C) U$225.1(C)
N$324: D223.1(C) U$224.1(C)
N$327: D225.1(C) U$226.1(C)
N$328: D226.1(C) U$227.1(C)
N$329: D228.1(C) U$229.1(C)
N$330: D227.1(C) U$228.1(C)
N$331: D229.1(C) U$230.1(C)
N$332: D230.1(C) U$231.1(C)
N$333: D232.1(C) U$233.1(C)
N$334: D231.1(C) U$232.1(C)
N$335: D233.1(C) U$234.1(C)
N$336: D234.1(C) U$235.1(C)
N$337: D236.1(C) U$237.1(C)
N$338: D235.1(C) U$236.1(C)
N$339: D237.1(C) U$238.1(C)
N$340: D238.1(C) U$239.1(C)
N$341: D240.1(C) U$241.1(C)
N$342: D239.1(C) U$240.1(C)
N$345: D241.1(C) U$242.1(C)
N$346: D242.1(C) U$243.1(C)
N$347: D244.1(C) U$245.1(C)
N$348: D243.1(C) U$244.1(C)
N$349: D245.1(C) U$246.1(C)
N$350: D246.1(C) U$247.1(C)
N$351: D248.1(C) U$249.1(C)
N$352: D247.1(C) U$248.1(C)
N$353: D249.1(C) U$250.1(C)
N$354: D250.1(C) U$251.1(C)
N$355: D252.1(C) U$253.1(C)
N$356: D251.1(C) U$252.1(C)
N$357: D253.1(C) U$254.1(C)
N$358: D254.1(C) U$255.1(C)
N$359: D256.1(C) U$257.1(C)
N$360: D255.1(C) U$256.1(C)
P1: D1.2(A) D4.2(A) D17.2(A) D20.2(A) D33.2(A) D36.2(A) D49.2(A) D52.2(A) D65.2(A) D68.2(A) D81.2(A) D84.2(A) D97.2(A) D100.2(A) D113.2(A) D116.2(A) Q1.3(C)
P2: D2.2(A) D3.2(A) D18.2(A) D19.2(A) D34.2(A) D35.2(A) D50.2(A) D51.2(A) D66.2(A) D67.2(A) D82.2(A) D83.2(A) D98.2(A) D99.2(A) D114.2(A) D115.2(A) Q2.3(C)
P3: D5.2(A) D8.2(A) D21.2(A) D24.2(A) D37.2(A) D40.2(A) D53.2(A) D56.2(A) D69.2(A) D72.2(A) D85.2(A) D88.2(A) D101.2(A) D104.2(A) D117.2(A) D120.2(A) Q3.3(C)
P4: D6.2(A) D7.2(A) D22.2(A) D23.2(A) D38.2(A) D39.2(A) D54.2(A) D55.2(A) D70.2(A) D71.2(A) D86.2(A) D87.2(A) D102.2(A) D103.2(A) D118.2(A) D119.2(A) Q4.3(C)
P5: D9.2(A) D12.2(A) D25.2(A) D28.2(A) D41.2(A) D44.2(A) D57.2(A) D60.2(A) D73.2(A) D76.2(A) D89.2(A) D92.2(A) D105.2(A) D108.2(A) D121.2(A) D124.2(A) Q5.3(C)
P6: D10.2(A) D11.2(A) D26.2(A) D27.2(A) D42.2(A) D43.2(A) D58.2(A) D59.2(A) D74.2(A) D75.2(A) D90.2(A) D91.2(A) D106.2(A) D107.2(A) D122.2(A) D123.2(A) Q6.3(C)
P7: D13.2(A) D16.2(A) D29.2(A) D32.2(A) D45.2(A) D48.2(A) D61.2(A) D64.2(A) D77.2(A) D80.2(A) D93.2(A) D96.2(A) D109.2(A) D112.2(A) D125.2(A) D128.2(A) Q7.3(C)
P8: D14.2(A) D15.2(A) D30.2(A) D31.2(A) D46.2(A) D47.2(A) D62.2(A) D63.2(A) D78.2(A) D79.2(A) D94.2(A) D95.2(A) D110.2(A) D111.2(A) D126.2(A) D127.2(A) Q8.3(C)
P9: D129.2(A) D132.2(A) D145.2(A) D148.2(A) D161.2(A) D164.2(A) D177.2(A) D180.2(A) D193.2(A) D196.2(A) D209.2(A) D212.2(A) D225.2(A) D228.2(A) D241.2(A) D244.2(A) Q9.3(C)
P10: D130.2(A) D131.2(A) D146.2(A) D147.2(A) D162.2(A) D163.2(A) D178.2(A) D179.2(A) D194.2(A) D195.2(A) D210.2(A) D211.2(A) D226.2(A) D227.2(A) D242.2(A) D243.2(A) Q10.3(C)
P11: D133.2(A) D136.2(A) D149.2(A) D152.2(A) D165.2(A) D168.2(A) D181.2(A) D184.2(A) D197.2(A) D200.2(A) D213.2(A) D216.2(A) D229.2(A) D232.2(A) D245.2(A) D248.2(A) Q11.3(C)
P12: D134.2(A) D135.2(A) D150.2(A) D151.2(A) D166.2(A) D167.2(A) D182.2(A) D183.2(A) D198.2(A) D199.2(A) D214.2(A) D215.2(A) D230.2(A) D231.2(A) D246.2(A) D247.2(A) Q12.3(C)
P13: D137.2(A) D140.2(A) D153.2(A) D156.2(A) D169.2(A) D172.2(A) D185.2(A) D188.2(A) D201.2(A) D204.2(A) D217.2(A) D220.2(A) D233.2(A) D236.2(A) D249.2(A) D252.2(A) Q13.3(C)
P14: D138.2(A) D139.2(A) D154.2(A) D155.2(A) D170.2(A) D171.2(A) D186.2(A) D187.2(A) D202.2(A) D203.2(A) D218.2(A) D219.2(A) D234.2(A) D235.2(A) D250.2(A) D251.2(A) Q14.3(C)
P15: D141.2(A) D144.2(A) D157.2(A) D160.2(A) D173.2(A) D176.2(A) D189.2(A) D192.2(A) D205.2(A) D208.2(A) D221.2(A) D224.2(A) D237.2(A) D240.2(A) D253.2(A) D256.2(A) Q15.3(C)
P16: D142.2(A) D143.2(A) D158.2(A) D159.2(A) D174.2(A) D175.2(A) D190.2(A) D191.2(A) D206.2(A) D207.2(A) D222.2(A) D223.2(A) D238.2(A) D239.2(A) D254.2(A) D255.2(A) Q16.3(C)
S1: U$5.10(S0)
S2: U$5.11(S1)
S3: U$5.14(S2)
S4: U$5.13(S3)
S5: IC2.23(A)
S6: IC2.22(B)
S7: IC2.21(C)
S8: IC2.20(D)
THRESHOLD: IC1.3(+IN1) IC1.6(-IN2) IC1.7(OUT2)
VCC: C1.A(+) C2.A(+) C4.A(+) IC1.8(+V) IC2.24(VCC) Q1.2(E) Q2.2(E) Q3.2(E) Q4.2(E) Q5.2(E) Q6.2(E) Q7.2(E) Q8.2(E) Q9.2(E) Q10.2(E) Q11.2(E) Q12.2(E) Q13.2(E) Q14.2(E) Q15.2(E) Q16.2(E) R18.2 U$5.24(VCC)
Y1: R1.1 U$5.9(CHAN0) U$114.2(E) U$115.2(E) U$118.2(E) U$119.2(E) U$122.2(E) U$123.2(E) U$126.2(E) U$127.2(E) U$242.2(E) U$243.2(E) U$246.2(E) U$247.2(E) U$250.2(E) U$251.2(E) U$254.2(E) U$255.2(E)
Y2: R2.1 U$5.8(CHAN1) U$116.2(E) U$117.2(E) U$120.2(E) U$121.2(E) U$124.2(E) U$125.2(E) U$128.2(E) U$129.2(E) U$244.2(E) U$245.2(E) U$248.2(E) U$249.2(E) U$252.2(E) U$253.2(E) U$256.2(E) U$257.2(E)
Y3: R3.1 U$5.7(CHAN2) U$98.2(E) U$99.2(E) U$102.2(E) U$103.2(E) U$106.2(E) U$107.2(E) U$110.2(E) U$111.2(E) U$226.2(E) U$227.2(E) U$230.2(E) U$231.2(E) U$234.2(E) U$235.2(E) U$238.2(E) U$239.2(E)
Y4: R4.1 U$5.6(CHAN3) U$100.2(E) U$101.2(E) U$104.2(E) U$105.2(E) U$108.2(E) U$109.2(E) U$112.2(E) U$113.2(E) U$228.2(E) U$229.2(E) U$232.2(E) U$233.2(E) U$236.2(E) U$237.2(E) U$240.2(E) U$241.2(E)
Y5: R5.1 U$5.5(CHAN4) U$82.2(E) U$83.2(E) U$86.2(E) U$87.2(E) U$90.2(E) U$91.2(E) U$94.2(E) U$95.2(E) U$210.2(E) U$211.2(E) U$214.2(E) U$215.2(E) U$218.2(E) U$219.2(E) U$222.2(E) U$223.2(E)
Y6: R6.1 U$5.4(CHAN5) U$84.2(E) U$85.2(E) U$88.2(E) U$89.2(E) U$92.2(E) U$93.2(E) U$96.2(E) U$97.2(E) U$212.2(E) U$213.2(E) U$216.2(E) U$217.2(E) U$220.2(E) U$221.2(E) U$224.2(E) U$225.2(E)
Y7: R7.1 U$5.3(CHAN6) U$66.2(E) U$67.2(E) U$70.2(E) U$71.2(E) U$74.2(E) U$75.2(E) U$78.2(E) U$79.2(E) U$194.2(E) U$195.2(E) U$198.2(E) U$199.2(E) U$202.2(E) U$203.2(E) U$206.2(E) U$207.2(E)
Y8: R8.1 U$5.2(CHAN7) U$68.2(E) U$69.2(E) U$72.2(E) U$73.2(E) U$76.2(E) U$77.2(E) U$80.2(E) U$81.2(E) U$196.2(E) U$197.2(E) U$200.2(E) U$201.2(E) U$204.2(E) U$205.2(E) U$208.2(E) U$209.2(E)
Y9: R9.1 U$5.23(CHAN8) U$50.2(E) U$51.2(E) U$54.2(E) U$55.2(E) U$58.2(E) U$59.2(E) U$62.2(E) U$63.2(E) U$178.2(E) U$179.2(E) U$182.2(E) U$183.2(E) U$186.2(E) U$187.2(E) U$190.2(E) U$191.2(E)
Y10: R10.1 U$5.22(CHAN9) U$52.2(E) U$53.2(E) U$56.2(E) U$57.2(E) U$60.2(E) U$61.2(E) U$64.2(E) U$65.2(E) U$180.2(E) U$181.2(E) U$184.2(E) U$185.2(E) U$188.2(E) U$189.2(E) U$192.2(E) U$193.2(E)
Y11: R11.1 U$5.21(CHAN10) U$34.2(E) U$35.2(E) U$38.2(E) U$39.2(E) U$42.2(E) U$43.2(E) U$46.2(E) U$47.2(E) U$162.2(E) U$163.2(E) U$166.2(E) U$167.2(E) U$170.2(E) U$171.2(E) U$174.2(E) U$175.2(E)
Y12: R12.1 U$5.20(CHAN11) U$36.2(E) U$37.2(E) U$40.2(E) U$41.2(E) U$44.2(E) U$45.2(E) U$48.2(E) U$49.2(E) U$164.2(E) U$165.2(E) U$168.2(E) U$169.2(E) U$172.2(E) U$173.2(E) U$176.2(E) U$177.2(E)
Y13: R13.1 U$5.19(CHAN12) U$18.2(E) U$19.2(E) U$22.2(E) U$23.2(E) U$26.2(E) U$27.2(E) U$30.2(E) U$31.2(E) U$146.2(E) U$147.2(E) U$150.2(E) U$151.2(E) U$154.2(E) U$155.2(E) U$158.2(E) U$159.2(E)
Y14: R14.1 U$5.18(CHAN13) U$20.2(E) U$21.2(E) U$24.2(E) U$25.2(E) U$28.2(E) U$29.2(E) U$32.2(E) U$33.2(E) U$148.2(E) U$149.2(E) U$152.2(E) U$153.2(E) U$156.2(E) U$157.2(E) U$160.2(E) U$161.2(E)
Y15: R15.1 U$1.2(E) U$2.2(E) U$5.17(CHAN14) U$6.2(E) U$7.2(E) U$10.2(E) U$11.2(E) U$14.2(E) U$15.2(E) U$130.2(E) U$131.2(E) U$134.2(E) U$135.2(E) U$138.2(E) U$139.2(E) U$142.2(E) U$143.2(E)
Y16: R16.1 U$3.2(E) U$4.2(E) U$5.16(CHAN15) U$8.2(E) U$9.2(E) U$12.2(E) U$13.2(E) U$16.2(E) U$17.2(E) U$132.2(E) U$133.2(E) U$136.2(E) U$137.2(E) U$140.2(E) U$141.2(E) U$144.2(E) U$145.2(E)
Unconnected: IC2.18(G1) IC2.19(G2)

## Library data of the parts
C1-C4 = 1_SparkFun-Capacitors:CAP_POL: Capacitor Polarized These are standard SMD and PTH capacitors. Normally 10uF, 47uF, and 100uF in electrolytic and tantalum varieties. Always verify the external diameter of the through hole cap, it varies with capacity, voltage, and manufacturer. The EIA devices should be standard.
D1-D256 = 1_SparkFun-DiscreteSemi:DIODE: Diode These are standard reverse protection diodes and small signal diodes. SMA package can handle up to about 1A. SOD-323 can handle about 200mA. What the SOD-323 package when ordering, there are some mfgs out there that are 5-pin packages.; PROD_ID: DIO-09646
IC1 = 1_SparkFun-AnalogIC:LMV358: Jellybean rail-to-rail output op-amp; PROD_ID: IC-09657
IC2 = 74xx-us:74*154: 4-line to 16-line data SELECTOR/MULTIPLEXER
Q1-Q16 = 1_SparkFun-DiscreteSemi:TRANSISTOR_PNP: Generic PNP BJT Double check pinouts against datasheets- not all devices are the same! MMBT3906 - 40V 200mA SOT-23 (TRANS-08052) MMBT4403 - 40V 600mA SOT-23 (TRANS-09245)
R1-R34 = 1_SparkFun-Resistors:RESISTOR: Resistor Basic schematic elements and footprints for 0603, 1206, and PTH resistors.
U$1-U$4 U$6-U$257 = 0_Tristan's_Lib:PT15-21B
U$5 = 1_SparkFun-AnalogIC:MUX-74HC4067: 16-channel analog MUX